# EAGLE design potuino (EAGLE 6.4)
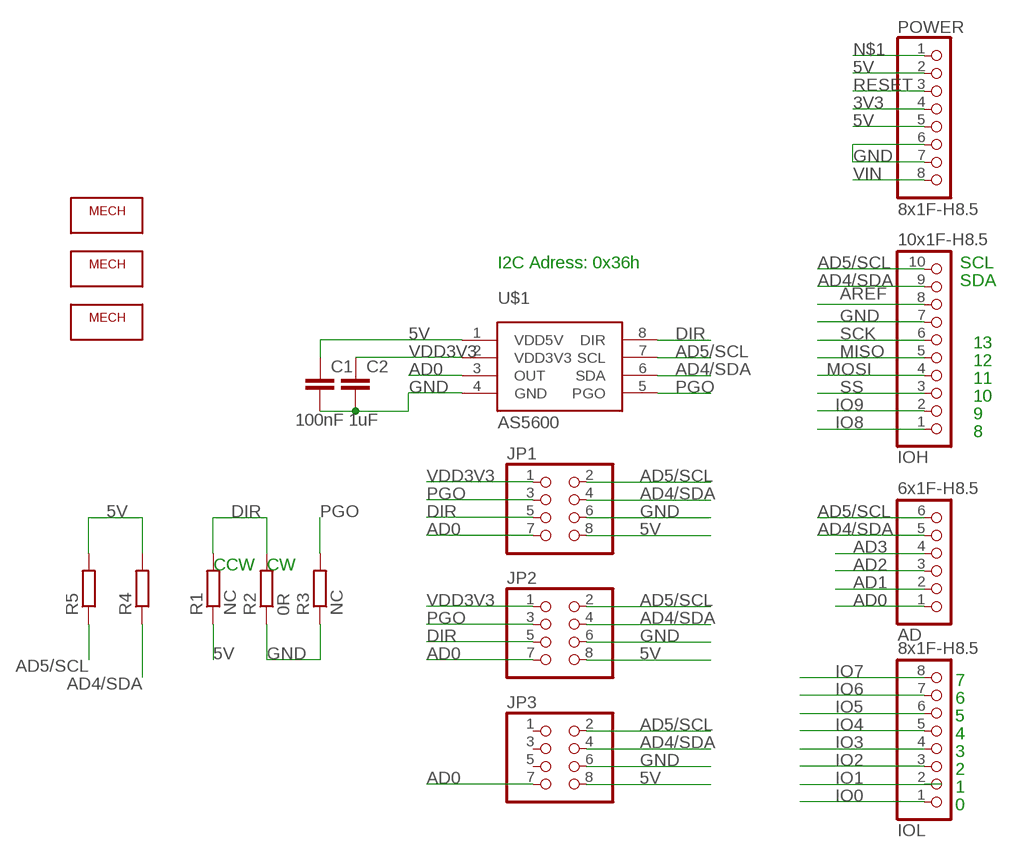
[diagram p0: schematic, sheet 1]

## Parts
AD  6x1F-H8.5  PINHD-1X6  [1X06]
C1  100nF  C-EUC0805  [C0805]
C2  1uF  C-EUC0805  [C0805]
IOH  10x1F-H8.5  PINHD-1X10_ARD  [1X10]
IOL  8x1F-H8.5  PINHD-1X8  [1X08]
JP1  PINHD-2X04_2.54  [2X04]
JP2  PINHD-2X04_2.54  [2X04]
JP3  PINHD-2X04_2.54  [2X04]
POWER  8x1F-H8.5  PINHD-1X8  [1X08]
R1  NC  R-EU_R0603  [R0603]
R2  0R  R-EU_R0603  [R0603]
R3  NC  R-EU_R0603  [R0603]
R4  R-EU_R0603  [R0603]
R5  R-EU_R0603  [R0603]
U$1  AS5600  [SO08]
U$2  MECHANICAL  [MECHANICAL-PARTS]
U$3  MECHANICAL  [MECHANICAL-PARTS]
U$4  MECHANICAL2  [MECHANICAL-TOP]

## Nets
3V3: POWER.4
5V: C1.1 JP1.8 JP2.8 JP3.8 POWER.2 POWER.5 R1.1 R4.2 R5.2 U$1.1(VDD5V)
AD0: AD.1 JP1.7 JP2.7 JP3.7 U$1.3(OUT)
AD1: AD.2
AD2: AD.3
AD3: AD.4
AD4/SDA: AD.5 IOH.9 JP1.4 JP2.4 JP3.4 R4.1 U$1.6(SDA)
AD5/SCL: AD.6 IOH.10 JP1.2 JP2.2 JP3.2 R5.1 U$1.7(SCL)
AREF [aref]: IOH.8
DIR: JP1.5 JP2.5 R1.2 R2.2 U$1.8(DIR)
GND [gnd]: C1.2 C2.2 IOH.7 JP1.6 JP2.6 JP3.6 POWER.6 POWER.7 R2.1 R3.1 U$1.4(GND)
IO0: IOL.1
IO1: IOL.2
IO2: IOL.3
IO3: IOL.4
IO4: IOL.5
IO5: IOL.6
IO6: IOL.7
IO7: IOL.8
IO8: IOH.1
IO9: IOH.2
MISO: IOH.5
MOSI: IOH.4
N$1: POWER.1
PGO: JP1.3 JP2.3 R3.2 U$1.5(PGO)
RESET: POWER.3
SCK: IOH.6
SS: IOH.3
VDD3V3: C2.1 JP1.1 JP2.1 U$1.2(VDD3V3)
VIN: POWER.8
Unconnected: JP3.1 JP3.3 JP3.5

## Notes on the sheet
- I2C Adress: 0x36h | SCL
- SDA
- 13
- 12
- 11
- 10
- 9
- 8
- CCW | CW
- 7
- 6
- 5
- 4
- 3
- 2
- 1
- 0

## Library data of the parts
AD = SmartPrj:PINHD-1X6: PIN HEADER
C1 C2 = rcl:C-EU: CAPACITOR, European symbol
IOH = SmartPrj:PINHD-1X10_ARD: PIN HEADER
IOL POWER = SmartPrj:PINHD-1X8: PIN HEADER
JP1-JP3 = pinhead-2:PINHD-2X04: PIN HEADER
R1-R5 = rcl:R-EU_: RESISTOR, European symbol
U$1 = AMS:AS5600
U$2 U$3 = AMS:MECHANICAL
U$4 = AMS:MECHANICAL2

## Net classes
0 default: width 0.254 mm, clearance 0.355 mm
1 power: width 0.61 mm, drill 0.61 mm, clearance 0.254 mm
2 gnd: width 0.305 mm, drill 0.559 mm, clearance 0.355 mm to class 0, clearance 0.355 mm to class 1, clearance 0.355 mm
3 usbvcc: width 0.508 mm, drill 0.61 mm, clearance 0.254 mm
4 aref: width 0.406 mm, drill 0.61 mm, clearance 0.355 mm to class 0, clearance 0.355 mm to class 1, clearance 0.355 mm to class 2, clearance 0.355 mm to class 3, clearance 0.355 mm

## Board
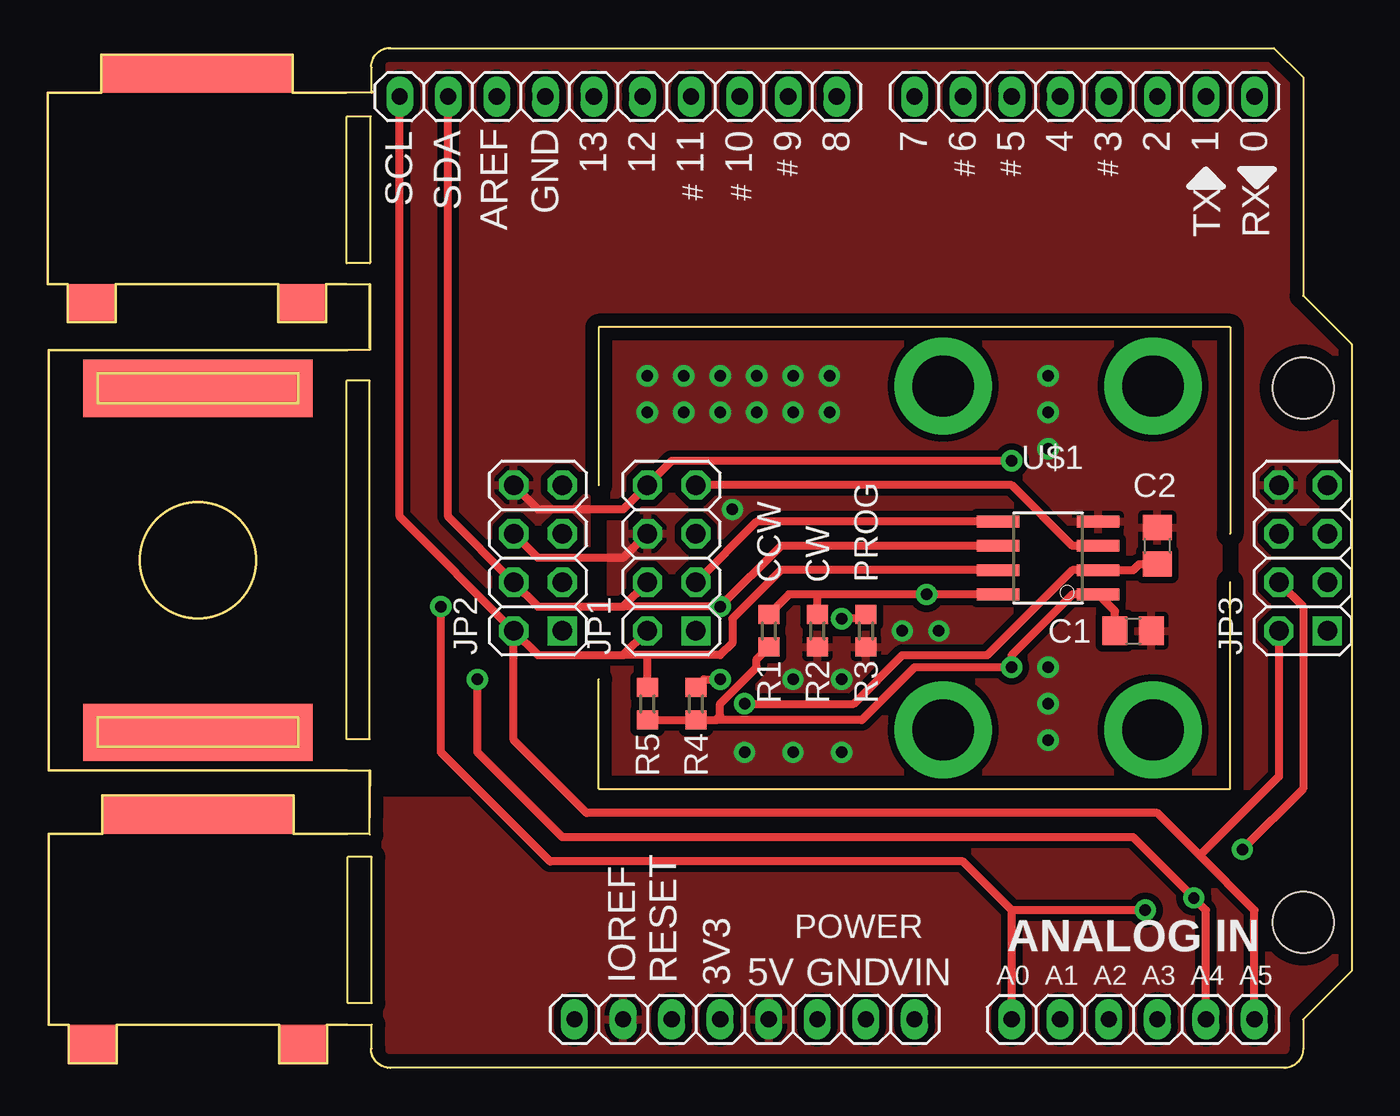
[diagram p1: board, top side]
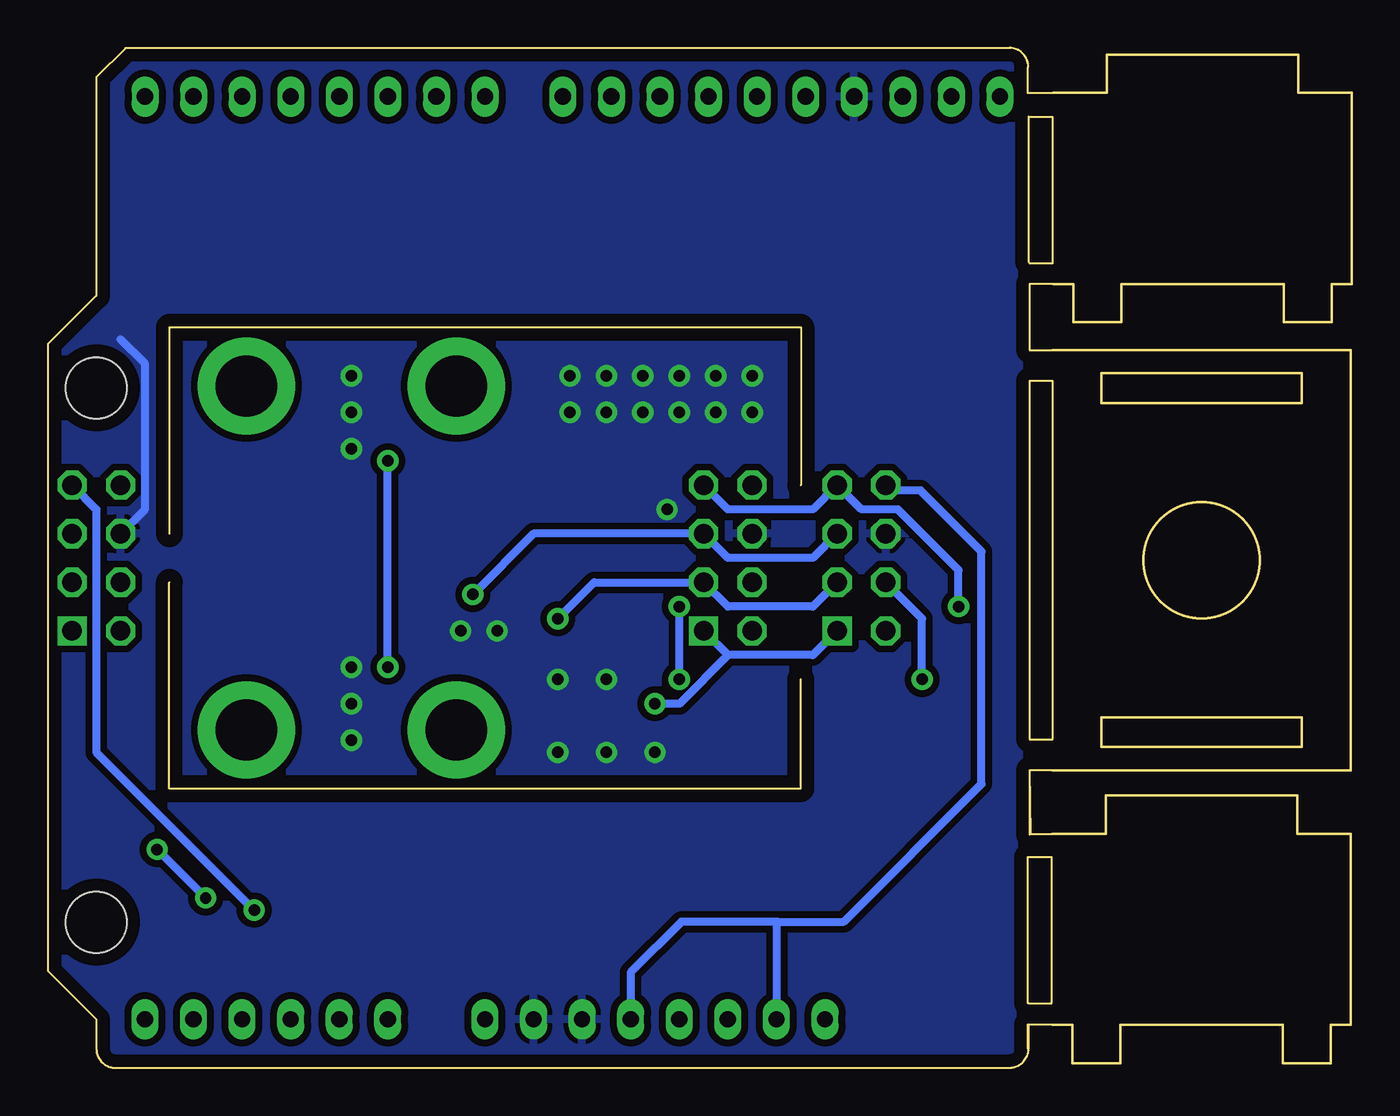
[diagram p2: board, bottom side, seen from below]

Size 68.18 x 53.35 mm. Coordinates in mm from the lower left corner, seen from the top.
Outline: 17.75,0 64.64,0 arc90 65.64,1 65.64,2.54 68.18,5.08 68.18,37.85 65.64,40.39 65.64,51.82 64.12,53.34 17.8,53.34
Outline: 28.81,30.48 28.81,38.73 61.83,38.73 61.83,27.94
Outline: 28.81,20.32 28.81,14.61 61.83,14.61 61.83,25.4
Outline: 16.94,51.05 16.94,52.31
Outline: 16.94,1 16.94,2.27
Outline: 17.9,0.01 arc-90 16.9,1.01
Outline: 16.91,52.35 arc-90 17.91,53.35
Outline: 16.84,37.66 16.84,41.02
Outline: 16.84,12.21 16.84,15.56
Outline: 16.89,42.16 16.89,49.77
Outline: 16.85,49.73 15.64,49.73 15.64,42.09 16.85,42.09
Outline: 15.69,3.4 15.69,11.04 16.94,11.04 16.94,3.4
Outline: 16.9,3.38 15.69,3.38
Outline: 16.95,51.1 16.95,51 12.8,51 12.8,53 2.8,53 2.8,51 0,51 0,41 1.05,41 1.05,39 3.55,39 3.55,41 12.05,41 12.05,39 14.55,39 14.55,41 16.85,41 16.85,37.55 0.05,37.55 0.05,15.55 16.85,15.55 16.8,12.25 12.85,12.25 12.85,14.25 2.85,14.25 2.85,12.25 0.05,12.25 0.05,2.25 1.1,2.25 1.1,0.25 3.6,0.25 3.6,2.25 12.1,2.25 12.1,0.25 14.6,0.25 14.6,2.25 16.9,2.25 16.9,1.01
Outline: 16.9,1.01 16.9,1
Outline: 16.85,17.18 16.84,17.18
Outline: 16.84,17.18 15.64,17.18 15.64,35.94 16.84,35.94 16.84,17.18
Copper layers (1*16): Top 0.035mm / dielectric 1.5mm / Bottom 0.035mm
Design rules "default": minimum track width 10mil, minimum drill 22mil, track to track 10mil, track to pad 10mil, pad to pad 10mil, via to via 12mil, smd to smd 8mil, copper to edge 26mil, drill to drill 12mil, minimum pad ring 10mil, minimum via ring 10mil, stop-mask expansion 1mil, vias tented up to drill 30mil, thermal gap 10mil
Holes 3.2 mm at 65.64,35.56 65.64,7.62
vRestrict: area 22.5,44.1 to 24.2,49.1; area 25,45.5 to 26.7,49.1; area 28,45.3 to 29.2,48.8; area 30.6,45.3 to 31.7,48.8; area 33.1,45.3 to 34.3,48.8; area 35.7,45.3 to 36.8,48.8; area 38.3,47.2 to 39.5,48.8; area 59.9,44.2 to 61.3,46.7; area 62.5,44.2 to 63.9,46.7; area 44.4,47.5 to 45.7,48.9; area 47.2,47.4 to 48.4,48.9; area 49.8,47.4 to 50.9,48.9; area 52.4,47.4 to 53.6,48.9; area 54.8,47.4 to 56,48.9; area 57.5,47.4 to 58.7,48.9; area 60.1,47.4 to 61.2,48.9; area 62.6,47.4 to 63.7,48.9; area 40.9,47.2 to 42,48.8

### Footprints (pad centres in the part's own frame; a part is rotated, then mirrored left to right if it is on the bottom)
1X06 = drill 0.85 pad 1.422 long: 1 -6.35,0; 2 -3.81,0; 3 -1.27,0; 4 1.27,0; 5 3.81,0; 6 6.35,0
C0805 = smd 1.3 x 1.5: 1 -0.95,0; 2 0.95,0
1X10@1 = drill 0.85 pad 1.422 long: 1 -11.43,0; 2 -8.89,0; 3 -6.35,0; 4 -3.81,0; 5 -1.27,0; 6 1.27,0; 7 3.81,0; 8 6.35,0; 9 8.89,0; 10 11.43,0
1X08 = drill 0.85 pad 1.422 long: 1 -8.89,0; 2 -6.35,0; 3 -3.81,0; 4 -1.27,0; 5 1.27,0; 6 3.81,0; 7 6.35,0; 8 8.89,0
2X04 = drill 1.016 square: 1 -3.81,-1.27 | drill 1.016 octagon: 2 -3.81,1.27; 3 -1.27,-1.27; 4 -1.27,1.27; 5 1.27,-1.27; 6 1.27,1.27; 7 3.81,-1.27; 8 3.81,1.27
R0603 = smd 1 x 1.1: 1 -0.85,0; 2 0.85,0
SO08 = smd 0.61 x 2.21: 1 -1.905,-2.616; 2 -0.635,-2.616; 3 0.635,-2.616; 4 1.905,-2.616; 5 1.905,2.616; 6 0.635,2.616; 7 -0.635,2.616; 8 -1.905,2.616
MECHANICAL-PARTS = smd 10 x 2: P$1 0,11 | smd 2.5 x 2: P$2 -5.5,-1; P$3 5.5,-1
MECHANICAL-TOP = smd 3 x 12: P$1 -9,0; P$2 9,0

### Placement (x,y rotation side)
AD  56.75,2.54 0 top
C1  56.75,22.86 0 top
C2  58.02,27.3 90 top
IOH  10x1F-H8.5  [1X10@1]  29.83,50.8 180 top
IOL  54.21,50.8 180 top
JP1  32.62,26.67 90 top
JP2  25.64,26.67 90 top
JP3  65.64,26.67 90 top
POWER  36.43,2.54 0 top
R1  37.7,22.86 90 top
R2  40.24,22.86 90 top
R3  42.78,22.86 90 top
R4  33.89,19.05 270 top
R5  31.35,19.05 270 top
U$1  52.3,26.67 90 top
U$2  7.8,41 0 top
U$3  7.85,2.25 0 top
U$4  7.85,26.55 270 top

### Tracks (layer width: path | path; a pad name or v marks a point on that pad's centre or on a via)
5V  (via drill 0.6)
  Top 0.406: JP2.8 25.64,29.21 30.08,29.21 JP1.8 32.62,31.75 v50.4,31.75 | R5.2 R4.2 34.95,18.2 | 34.95,18.2 35.16,18.41 35.16,19.05 37.07,20.95 37.07,21.38 R1.1 | C1.1 55.8,23.89 U$1.1 53.58,24.77 50.4,21.59 v50.4,20.95 45.32,20.95 42.57,18.2 34.95,18.2
  Bottom 0.406: v50.4,20.95 v50.4,31.75 | POWER.2 30.05,2.54 30.05,7.65 | 30.05,7.65 26.55,7.65 19.35,14.85 19.35,27 22.55,30.2 24.09,30.2 JP2.8 | 30.05,7.65 35.05,7.65 37.7,5 POWER.5
  pour Top: 16.16,0.05 68.18,0 68.18,40.01 62.47,40.01 62.47,13.97 16.11,13.97
  pour Top: 16.11,12.7 16.11,53.34 68.18,53.34 68.18,38.1 63.1,38.1 63.1,39.37 28.18,39.37 28.18,12.7
AD0  (via drill 0.6)
  Top 0.406: U$1.3 53.58,27.3 50.4,30.48 JP1.7 | AD.1 50.4,8.26 | 50.4,8.26 47.86,10.79 26.27,10.79 20.55,16.51 v20.55,24.13 | v57.38,8.26 50.4,8.26
  Bottom 0.406: JP1.7 32.62,29.21 28.18,29.21 JP2.7 25.64,29.21 23.73,29.21 20.55,26.04 v20.55,24.13 | JP3.7 65.64,29.21 65.64,16.51 v57.38,8.26
AD4/SDA  (via drill 0.6)
  Top 0.406: 30.08,24.13 25.64,24.13 JP2.4 20.94,28.83 IOH.9 | 30.08,24.13 JP1.4 | U$1.6 38.34,27.3 v35.16,24.13 30.08,24.13 | R4.1 34.31,20.32 v35.16,20.32 | AD.5 60.56,8.26 v59.93,8.89 56.75,12.06 26.91,12.06 22.46,16.51 v22.46,20.32 | JP3.4 65.64,24.13 65.64,14.61 v62.47,11.43
  Bottom 0.406: v35.16,20.32 v35.16,24.13 | v22.46,20.32 22.46,23.5 JP2.4 | v62.47,11.43 v59.93,8.89
AD5/SCL
  Top 0.406: JP2.2 25.64,21.59 30.08,21.59 | 30.08,21.59 JP1.2 | JP2.2 18.4,28.83 IOH.10 | U$1.7 38.34,26.04 35.8,23.5 35.8,22.23 35.16,21.59 31.35,21.59 | 31.35,21.59 30.08,21.59 | R5.1 31.35,21.59 | AD.6 63.1,8.26 60.24,11.11 | 60.24,11.11 58.02,13.34 28.18,13.34 24.37,17.14 JP2.2 | JP3.2 64.37,15.24 60.24,11.11
DIR  (via drill 0.6)
  Top 0.406: U$1.8 v45.95,24.77 40.24,24.77 | 40.24,24.77 38.76,24.77 R1.2 | R2.2 40.24,24.77
  Bottom 0.406: JP2.5 28.18,26.67 32.62,26.67 JP1.5 42.78,27.94 v45.95,24.77
GND  (via drill 0.6)
  Top 0.406: JP1.6 30.08,26.67 25.64,26.67 JP2.6
  Bottom 0.406: JP3.6 63.1,29.21 63.1,36.83 64.37,38.1
  other vias: 31.35,36.2 37.07,34.29 37.07,36.2 35.16,36.2 35.16,34.29 33.26,34.29 31.35,34.29 52.3,20.95 52.3,19.05 52.3,17.14 46.59,22.86 44.69,22.86 41.51,20.32 38.97,20.32 52.3,34.29 52.3,32.38 38.97,34.29 40.88,34.29 40.88,36.2 38.97,36.2 33.26,36.2 52.3,36.2 41.51,16.51 38.97,16.51 36.43,16.51 35.8,29.21
  pour Top: 29.45,38.1 61.2,38.1 61.2,15.24 29.45,15.24
  pour Bottom: 29.45,38.1 61.2,38.1 61.2,15.24 29.45,15.24
  pour Bottom: 17.38,53.34 68.18,53.98 68.18,0.64 17.38,0
N$2  (via drill 3.2 pad 5.08)
  other vias: 46.82,35.66
N$3  (via drill 3.2 pad 5.08)
  other vias: 46.82,17.68
N$4  (via drill 3.2 pad 5.08)
  other vias: 57.79,17.68
N$5  (via drill 3.2 pad 5.08)
  other vias: 57.79,35.66
PGO  (via drill 0.6)
  Top 0.406: U$1.5 37.07,28.57 JP1.3 | R3.2 42.57,23.5 v41.51,23.5
  Bottom 0.406: JP2.3 28.18,24.13 32.62,24.13 JP1.3 39.61,25.4 v41.51,23.5
VDD3V3  (via drill 0.6)
  Top 0.406: C2.1 57.07,26.36 56.75,26.04 U$1.2 53.58,26.04 49.13,21.59 44.69,21.59 42.15,19.05 v36.43,19.05
  Bottom 0.406: JP2.1 28.18,21.59 32.62,21.59 | JP1.1 32.62,21.59 | 32.62,21.59 35.16,19.05 v36.43,19.05

### Text on the board
tPlace: SCL | SDA | 13 | 12 | 11 | 10 | 9 | 8 | 7 | 6 | 5 | 4 | 3 | 2 | 1 | 0 | CCW | CW | PROG
tNames: AREF | GND | # | # | # | # | # | # | TX | RX | ANALOG IN | IOREF | RESET | 3V3 | 5V | GND | VIN | A0 | A1 | A2 | A3 | A4 | A5
214bmp: D:/SmartProjects/Snc/a4_bn_logo2.bmp